# Altium schematic sheet topV0.1.SchDoc
size A4; SheetNumber: 1; SheetTotal: 3
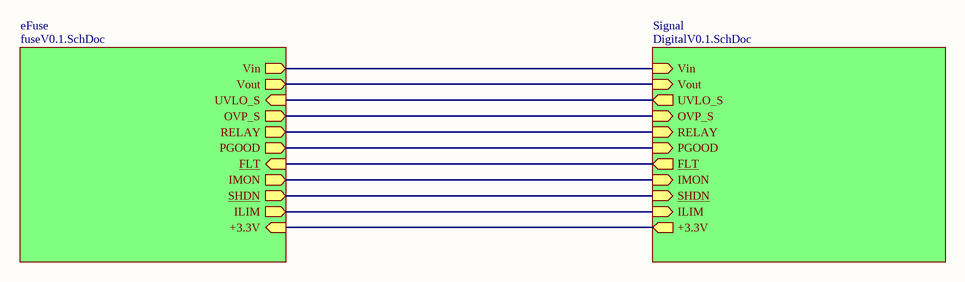
[diagram p0: topV0.1.SchDoc]

## Sub-sheets
eFuse = fuseV0.1.SchDoc: Vin (out), UVLO_S (in), OVP_S (out), RELAY (out), PGOOD (out), FLT (in), IMON (out), SHDN (out), ILIM (out), Vout (out), +3.3V (in)
Signal = DigitalV0.1.SchDoc: Vin (in), UVLO_S (out), OVP_S (in), RELAY (in), PGOOD (in), FLT (out), IMON (in), SHDN (in), ILIM (in), Vout (in), +3.3V (out)

## Nets
(unnamed): sheet eFuse/Vin, sheet Signal/Vin
(unnamed): sheet eFuse/UVLO_S, sheet Signal/UVLO_S
(unnamed): sheet eFuse/OVP_S, sheet Signal/OVP_S
(unnamed): sheet eFuse/RELAY, sheet Signal/RELAY
(unnamed): sheet eFuse/PGOOD, sheet Signal/PGOOD
(unnamed): sheet eFuse/FLT, sheet Signal/FLT
(unnamed): sheet eFuse/IMON, sheet Signal/IMON
(unnamed): sheet eFuse/SHDN, sheet Signal/SHDN
(unnamed): sheet eFuse/ILIM, sheet Signal/ILIM
(unnamed): sheet eFuse/Vout, sheet Signal/Vout
(unnamed): sheet eFuse/+3.3V, sheet Signal/+3.3V